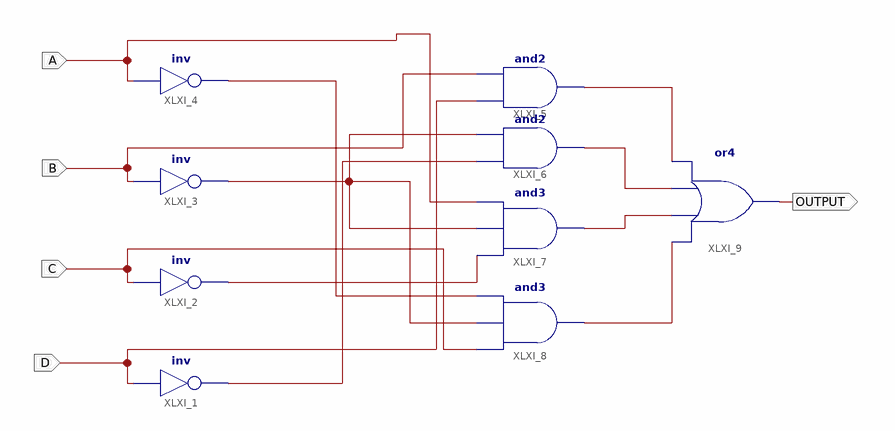
[diagram p0: schematic sheet 1]
// Xilinx ISE schematic Schematic_lab4.sch (spartan6) as structural Verilog: 9 symbols, 5 ports
module Schematic_lab4 (
  input  A,
  input  B,
  input  C,
  input  D,
  output OUTPUT
);

  wire XLXN_7, XLXN_8, XLXN_9, XLXN_10, XLXN_12, XLXN_13, XLXN_15, XLXN_16;

  not XLXI_1 (XLXN_13, D);
  not XLXI_2 (XLXN_15, C);
  not XLXI_3 (XLXN_12, B);
  not XLXI_4 (XLXN_16, A);
  and XLXI_5 (XLXN_7, D, B);
  and XLXI_6 (XLXN_8, XLXN_13, XLXN_12);
  and XLXI_7 (XLXN_9, XLXN_15, XLXN_12, A);
  and XLXI_8 (XLXN_10, C, XLXN_12, XLXN_16);
  or XLXI_9 (OUTPUT, XLXN_10, XLXN_9, XLXN_8, XLXN_7);
endmodule
